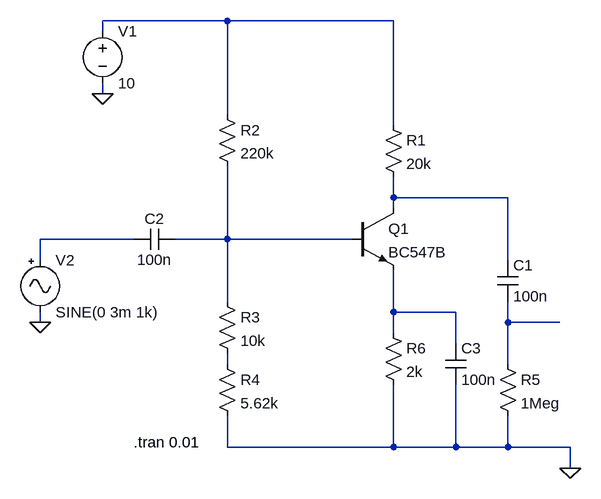
[diagram p0: schematic Draft15.asc]
Draft15.asc, the LTspice schematic file:
Version 4
SHEET 1 880 704
WIRE 224 0 32 0
WIRE 480 0 224 0
WIRE 32 16 32 0
WIRE 32 112 32 96
WIRE 224 144 224 0
WIRE 480 160 480 0
WIRE 480 272 480 240
WIRE 656 272 480 272
WIRE 480 288 480 272
WIRE 80 336 -64 336
WIRE 224 336 224 224
WIRE 224 336 144 336
WIRE 416 336 224 336
WIRE -64 368 -64 336
WIRE 656 368 656 272
WIRE 224 432 224 336
WIRE 480 448 480 384
WIRE 576 448 480 448
WIRE -64 464 -64 448
WIRE 656 464 656 432
WIRE 736 464 656 464
WIRE 480 480 480 448
WIRE 576 496 576 448
WIRE 224 528 224 512
WIRE 656 528 656 464
WIRE 224 656 224 608
WIRE 480 656 480 560
WIRE 480 656 224 656
WIRE 576 656 576 560
WIRE 576 656 480 656
WIRE 656 656 656 608
WIRE 656 656 576 656
WIRE 752 656 656 656
WIRE 752 688 752 656
FLAG 752 688 0
FLAG 32 112 0
FLAG -64 464 0
SYMBOL npn 416 288 R0
SYMATTR InstName Q1
SYMATTR Value BC547B
SYMBOL res 464 144 R0
SYMATTR InstName R1
SYMATTR Value 20k
SYMBOL res 208 128 R0
SYMATTR InstName R2
SYMATTR Value 220k
SYMBOL res 208 416 R0
SYMATTR InstName R3
SYMATTR Value 10k
SYMBOL res 208 512 R0
SYMATTR InstName R4
SYMATTR Value 5.62k
SYMBOL res 640 512 R0
SYMATTR InstName R5
SYMATTR Value 1Meg
SYMBOL cap 640 368 R0
SYMATTR InstName C1
SYMATTR Value 100n
SYMBOL cap 144 320 R90
WINDOW 0 0 32 VBottom 2
WINDOW 3 32 32 VTop 2
SYMATTR InstName C2
SYMATTR Value 100n
SYMBOL voltage 32 0 R0
SYMATTR InstName V1
SYMATTR Value 10
SYMBOL Misc/signal -64 352 R0
SYMATTR InstName V2
SYMATTR Value SINE(0 3m 1k)
SYMBOL res 464 464 R0
SYMATTR InstName R6
SYMATTR Value 2k
SYMBOL cap 560 496 R0
SYMATTR InstName C3
SYMATTR Value 100n
TEXT 80 648 Left 2 !.tran 0.01

The netlist it stands for:
* Draft15.asc
Q1 N002 N004 N005 0 BC547B
R1 N001 N002 20k
R2 N001 N004 220k
R3 N004 N007 10k
R4 N007 0 5.62k
R5 N006 0 1Meg
C1 N002 N006 100n
C2 N004 N003 100n
V1 N001 0 10
V2 N003 0 SINE(0 3m 1k)
R6 N005 0 2k
C3 N005 0 100n
.model NPN NPN
.model PNP PNP
.lib standard.bjt
.tran 0.01
.backanno
.end